# EAGLE design controller (EAGLE 7.2.0)
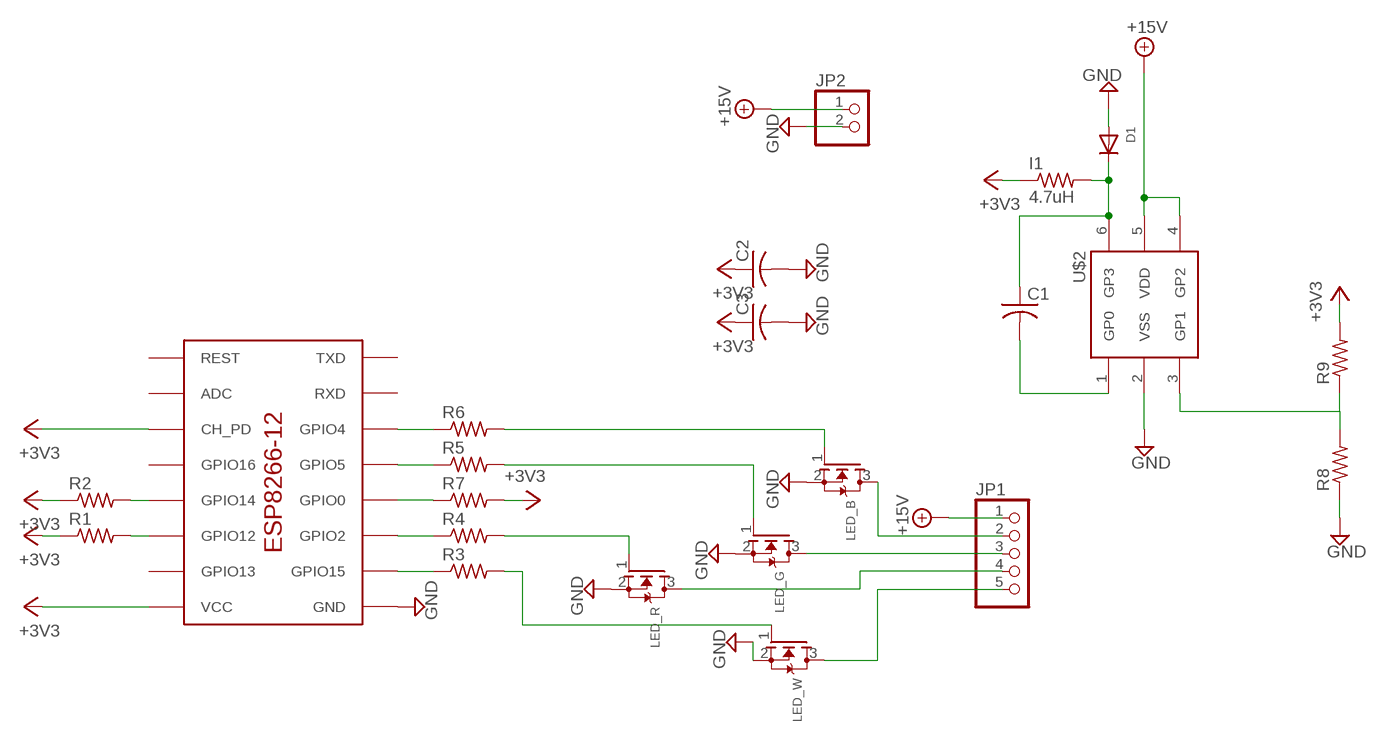
[diagram p0: schematic, sheet 1]

## Parts
C1  C-USC0805  [C0805]
C2  C-USC0805  [C0805]
C3  C-USC0805  [C0805]
D1  DIODESOT23_REFLOW  [SOT23-R]
I1  4.7uH  R-US_R0805  [R0805]
JP1  PINHD-1X5  [1X05]
JP2  PINHD-1X2  [1X02]
LED_B  MOSFET-NREFLOW  [SOT23]
LED_G  MOSFET-NREFLOW  [SOT23]
LED_R  MOSFET-NREFLOW  [SOT23]
LED_W  MOSFET-NREFLOW  [SOT23]
R1  R-US_R0805  [R0805]
R2  R-US_R0805  [R0805]
R3  R-US_R0805  [R0805]
R4  R-US_R0805  [R0805]
R5  R-US_R0805  [R0805]
R6  R-US_R0805  [R0805]
R7  R-US_R0805  [R0805]
R8  R-US_R0805  [R0805]
R9  R-US_R0805  [R0805]
U$1  ESP8266-12  [ESP8266-12]
U$2  10F200T  [SOT23-6]

## Nets
+3V3: C2.1 C3.1 I1.1 R1.1 R2.1 R7.2 R9.2 U$1.CH_PD U$1.VCC
+15V: JP1.1 JP2.1 U$2.4(GP2) U$2.5(VDD)
GND: C2.2 C3.2 D1.1(A) JP2.2 LED_B.2(S) LED_G.2(S) LED_R.2(S) LED_W.2(S) R8.1 U$1.GND U$2.2(VSS)
GPIO0: R7.1 U$1.GPIO0
GPIO2: R4.1 U$1.GPIO2
GPIO4: R6.1 U$1.GPIO4
GPIO5: R5.1 U$1.GPIO5
GPIO12: R1.2 U$1.GPIO12
GPIO14: R2.2 U$1.GPIO14
GPIO15: R3.1 U$1.GPIO15
N$1: JP1.5 LED_W.3(D)
N$2: JP1.4 LED_R.3(D)
N$3: JP1.2 LED_B.3(D)
N$4: JP1.3 LED_G.3(D)
N$5: C1.1 D1.3(C) I1.2 U$2.6(GP3)
N$6: C1.2 U$2.1(GP0)
N$7: LED_W.1(G) R3.2
N$8: LED_R.1(G) R4.2
N$9: LED_G.1(G) R5.2
N$10: LED_B.1(G) R6.2
N$11: R8.2 R9.1 U$2.3(GP1)
Unconnected: U$1.ADC U$1.GPIO13 U$1.GPIO16 U$1.REST U$1.RXD U$1.TXD

## Library data of the parts
C1-C3 = adafruit:C-US: CAPACITOR, American symbol
D1 = adafruit:DIODE: Diode SMADIODE - SMA Surface Mount Package 20V 1A Schottky Diode Digikey: 641-1014-6-ND DO-1N4148 - Through Hole Small Current Diode SOD-123 20V 1 A (.5mV Vf) Schottky Diode - Digikey: MBRX120TPMSCT-ND SOD-323 10V 570mA (.38mV Vf, 3ns) Schottky Diode - Digikey: ZLLS410CT-ND SOD-523 30V 30mA Schottky Diode (RB751S-40TE61) - Digikey: RB751S-40TE61CT-ND SOT23-R/W - SOT23 Package (R = Solder Paste/Reflow Ovens, W = Hand-Soldering) BAT54Film 40V 300mA - Digikey: 497-7162-1-ND
I1 R1-R9 = adafruit:R-US_: RESISTOR, American symbol
JP1 = pinhead:PINHD-1X5: PIN HEADER
JP2 = pinhead:PINHD-1X2: PIN HEADER
LED_B LED_G LED_R LED_W = adafruit:MOSFET-N: N-Channel Mosfet 2N7002E - 60V 260mA SOT23 [Digikey: 2N7002ET1GOSTR-ND] - REEL BSH103 - 30V 850mA SOT23 [Digikey: 568-5013-1-ND]
U$1 = captain-slow:ESP8266-12
U$2 = adafruit:10F200T: PIC10F200/202/204/206 Ultra-small 8-bit PIC micros in SOT-23-6 and SOIC

## Board
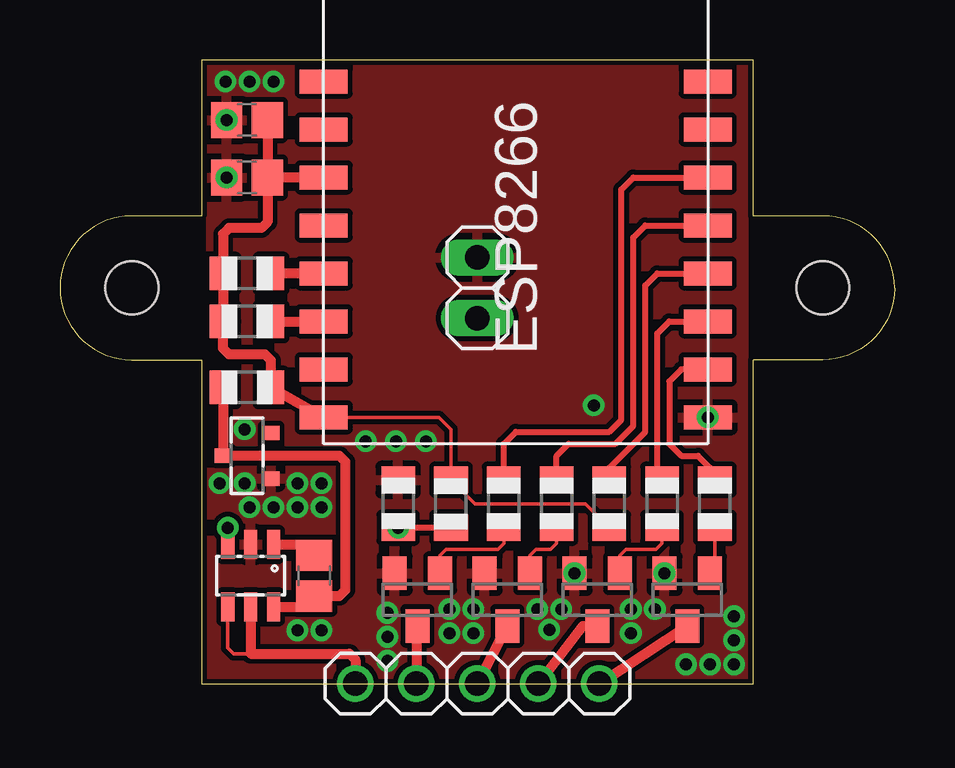
[diagram p1: board, top side]
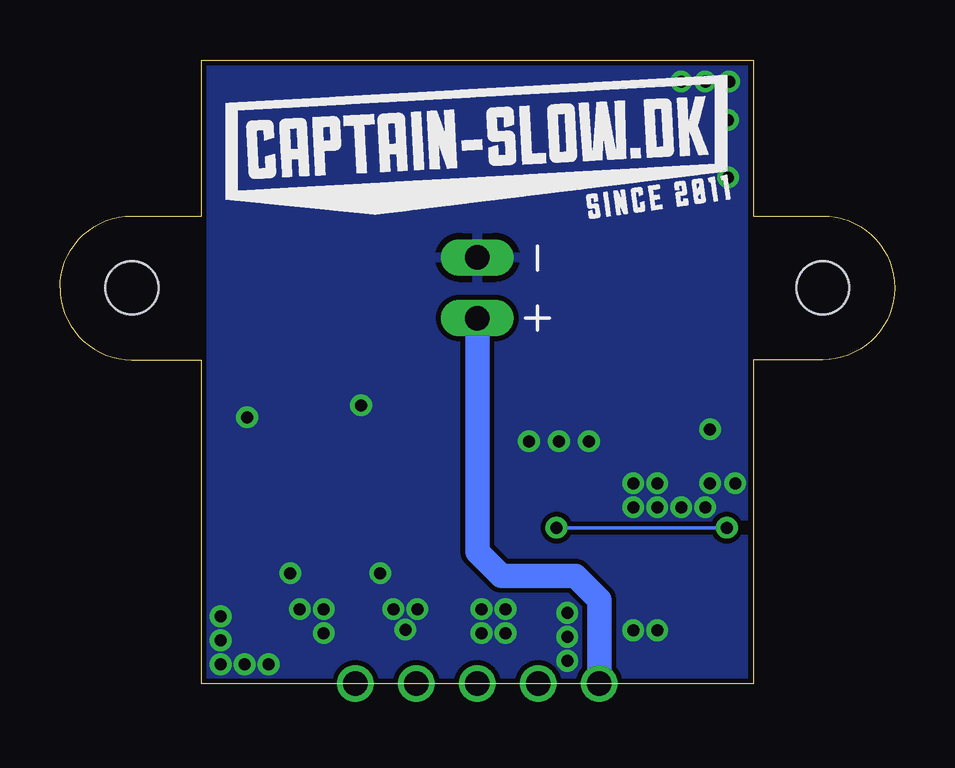
[diagram p2: board, bottom side, seen from below]

Size 34.8 x 26 mm. Coordinates in mm from the lower left corner, seen from the top.
Outline: 5.9,0 28.9,0 28.9,13.5 31.8,13.5 arc90 34.8,16.5 arc90 31.8,19.5 28.9,19.5 28.9,26 5.9,26 5.9,19.5 3,19.5 arc90 0,16.5 arc90 3,13.5 5.9,13.5 5.9,0
Copper layers (1*16): Top 0.035mm / dielectric 1.5mm / Bottom 0.035mm
Design rules "default *": minimum track width 10mil, minimum drill 24mil, track to track 8mil, track to pad 8mil, pad to pad 8mil, via to via 8mil, smd to smd 8mil, copper to edge 8mil, drill to drill 8mil, minimum pad ring 10mil, minimum via ring 8mil, stop-mask expansion 4mil, vias tented up to drill 1000mil, thermal gap 10mil
Holes 2.2 mm at 31.8,16.5 3,16.5

### Footprints (pad centres in the part's own frame; a part is rotated, then mirrored left to right if it is on the bottom)
C0805 = smd 1.3 x 1.5: 1 -0.85,0; 2 0.85,0
SOT23-R = smd 0.6 x 0.7: 1 -0.95,-1; 2 0.95,-1; 3 0,1
R0805 = smd 1.1 x 1.4: 1 -1,0; 2 1,0
1X05 = drill 1.016: 1 -5.08,0; 2 -2.54,0; 3 0,0; 4 2.54,0; 5 5.08,0
1X02 = drill 1.016 long: 1 -1.27,0; 2 1.27,0
SOT23 = smd 1 x 1.4: 1 -0.95,-1.1; 2 0.95,-1.1; 3 0,1.1
ESP8266-12 = smd 2 x 1: ADC -8,1.1; CH_PD -8,-0.9; GND 8,-10.9; GPIO0 8,-4.9; GPIO2 8,-6.9; GPIO4 8,-0.9; GPIO5 8,-2.9; GPIO12 -8,-6.9; GPIO13 -8,-8.9; GPIO14 -8,-4.9; GPIO15 8,-8.9; GPIO16 -8,-2.9; REST -8,3.1; RXD 8,1.1; TXD 8,3.1; VCC -8,-10.9
SOT23-6 = smd 0.55 x 1.2: 1 -0.95,-1.3; 2 0,-1.3; 3 0.95,-1.3; 4 0.95,1.3; 5 0,1.3; 6 -0.95,1.3

### Placement (x,y rotation side)
C1  10.6,4.5 90 top
C2  7.8,23.5 180 top
C3  7.8,21.1 180 top
D1  7.8,9.5 90 top
I1  7.8,12.35 180 top
JP1  17.4,0 0 top
JP2  17.4,16.5 90 top
LED_B  14.9,3.5 180 top
LED_G  18.65,3.5 180 top
LED_R  22.4,3.5 180 top
LED_W  26.15,3.5 180 top
R1  7.8,15.1 0 top
R2  7.8,17.1 0 top
R3  27.3,7.5 270 top
R4  25.1,7.5 270 top
R5  20.7,7.5 270 top
R6  18.5,7.5 270 top
R7  22.9,7.5 270 top
R8  14.1,7.5 270 top
R9  16.3,7.5 90 top
U$1  19,22 0 top
U$2  7.95,4.5 180 top
U$3  [CAPTAIN_SLOW_SMALL]  27.9,19 0 bottom

### Tracks (layer width: path | path; a pad name or v marks a point on that pad's centre or on a via)
+3V3
  Top 0.15: U$1.VCC 15.8,11.1 16.3,10.6 R9.2 17.3,7.5 21.9,7.5 R7.2
  Top 0.406: R1.1 7.15,15.1 | C2.1 C3.1 | U$1.CH_PD C3.1 | C3.1 8.65,19.25 8.4,19 7.05,19 6.8,18.75 R2.1 R1.1 | U$1.VCC I1.1 8.8,13.47 8.55,13.72 7.05,13.72 6.8,13.97 R1.1
+15V
  Top 0.15: U$2.4 7,1.5 7.25,1.25 7.95,1.25
  Top 0.406: U$2.5 7.95,1.25 12.07,1.25 12.32,1 JP1.1
  Bottom 1.016: JP2.1 17.4,5.5 16.4,4.5 13.32,4.5 12.32,3.5 JP1.1
GND  (via drill 0.5)
  other vias: 27,11.1 23.8,2.1 19.9,3.1 16.23,3.1 13.65,2.95 10.9,8.35 9.9,2.22 6.9,25.1 7.9,25.1 8.9,25.1 6.65,8.35 7.7,10.6 22.25,11.6 15.25,10.1 14,10.1 12.75,10.1 28.1,0.8 6.95,23.5 6.95,21.1 10.9,7.35 9.9,8.35 9.9,7.35 8.9,7.35 7.9,7.35 7.7,8.35 10.9,2.22 13.65,1.95 13.65,0.95 17.23,3.1 17.23,2.1 16.23,2.1 20.9,3.1 20.4,2.25 23.8,3.1 24.8,3.1 28.1,1.8 28.1,2.8 27.1,0.8 26.1,0.8 25.2,4.6 21.45,4.6
  pour Bottom: 6.31,0 6.31,26 28.49,26 28.49,0
  pour Top: 6.31,0 6.31,26 28.49,26 28.49,0
GPIO0
  Top 0.254: R7.1 22.9,9 24.4,10.5 24.4,16.6 24.9,17.1 U$1.GPIO0
GPIO2
  Top 0.254: R4.1 24.9,8.5 24.9,14.6 25.4,15.1 U$1.GPIO2
GPIO4
  Top 0.254: R6.1 18.5,10 19,10.5 22.9,10.5 23.4,11 23.4,20.6 23.9,21.1 U$1.GPIO4
GPIO5
  Top 0.254: R5.1 20.7,9.5 21.2,10 23.15,10 23.9,10.75 23.9,18.6 24.4,19.1 U$1.GPIO5
GPIO12
  Top 0.406: R1.2 U$1.GPIO12
GPIO14
  Top 0.406: U$1.GPIO14 R2.2
GPIO15
  Top 0.254: U$1.GPIO15 25.9,13.1 25.4,12.6 25.4,10 25.9,9.5 26.6,9.5 27.1,9 R3.1
N$1
  Top 0.406: LED_W.3 JP1.5
N$2
  Top 0.406: LED_R.3 21.8,2.4 JP1.4
N$3
  Top 0.406: JP1.2 LED_B.3
N$4
  Top 0.406: JP1.3 LED_G.3
N$5
  Top 0.406: U$2.6 10.4,3.2 C1.1 11.65,3.65 11.9,3.9 11.9,9.25 11.65,9.5 D1.3 I1.2
N$6
  Top 0.406: U$2.1 10.9,5.8 C1.2
N$7
  Top 0.15: LED_W.1 27.3,4.6 R3.2
N$8
  Top 0.15: R4.2 25.1,5.85 24.85,5.6 23.6,5.6 23.35,5.35 LED_R.1
N$9
  Top 0.15: LED_G.1 19.6,5.35 19.85,5.6 20.45,5.6 20.7,5.85 R5.2
N$10
  Top 0.15: LED_B.1 15.85,5.35 16.1,5.6 18.25,5.6 18.5,5.85 R6.2
  Top 0.254: 18.5,6.1 R6.2
N$11  (via drill 0.5)
  Top 0.15: U$2.3 v7,6.5
  Top 0.254: R9.1 R8.2
  Bottom 0.15: v7,6.5 R8.2
  other vias: 14.1,6.5